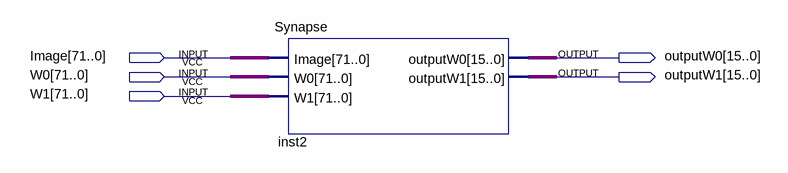
[diagram p0: schematic sheet]
// Quartus schematic Neuron.bdf as structural Verilog: 1 symbols, 5 pins
module Neuron (
  input  [71:0] Image,
  input  [71:0] W0,
  input  [71:0] W1,
  output [15:0] outputW0,
  output [15:0] outputW1
);

  Synapse inst2 (.Image(Image), .W0(W0), .W1(W1), .outputW0(outputW0), .outputW1(outputW1));
endmodule
